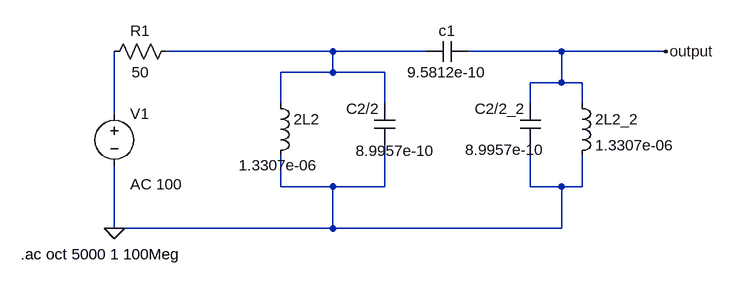
[diagram p0: schematic filtrPasmowoprzepustowyTypuPi.asc]
filtrPasmowoprzepustowyTypuPi.asc, the LTspice schematic file:
Version 4
SHEET 1 1032 680
WIRE 288 -16 32 -16
WIRE 432 -16 288 -16
WIRE 640 -16 496 -16
WIRE 800 -16 640 -16
WIRE 288 16 288 -16
WIRE 288 16 208 16
WIRE 368 16 288 16
WIRE 640 32 640 -16
WIRE 640 32 592 32
WIRE 672 32 640 32
WIRE 208 64 208 16
WIRE 368 64 368 16
WIRE 592 64 592 32
WIRE 672 64 672 32
WIRE -48 80 -48 -16
WIRE 208 192 208 144
WIRE 288 192 208 192
WIRE 368 192 368 128
WIRE 368 192 288 192
WIRE 592 192 592 128
WIRE 640 192 592 192
WIRE 672 192 672 144
WIRE 672 192 640 192
WIRE -48 256 -48 160
WIRE 288 256 288 192
WIRE 288 256 -48 256
WIRE 640 256 640 192
WIRE 640 256 288 256
FLAG -48 256 0
FLAG 800 -16 output
SYMBOL voltage -48 64 R0
WINDOW 123 24 124 Left 2
WINDOW 39 0 0 Left 0
SYMATTR Value2 AC 100
SYMATTR InstName V1
SYMATTR Value ""
SYMBOL res 48 -32 R90
WINDOW 0 0 56 VBottom 2
WINDOW 3 32 56 VTop 2
SYMATTR InstName R1
SYMATTR Value 50
SYMBOL ind 192 48 R0
WINDOW 3 -49 111 Left 2
SYMATTR InstName 2L2
SYMATTR Value 1.3307e-06
SYMBOL ind 656 48 R0
SYMATTR InstName 2L2_2
SYMATTR Value 1.3307e-06
SYMBOL cap 496 -32 R90
WINDOW 0 0 32 VBottom 2
WINDOW 3 32 32 VTop 2
SYMATTR InstName c1
SYMATTR Value 9.5812e-10
SYMBOL cap 384 128 R180
WINDOW 0 24 56 Left 2
WINDOW 3 -62 -9 Left 2
SYMATTR InstName C2/2
SYMATTR Value 8.9957e-10
SYMBOL cap 608 128 R180
WINDOW 0 24 56 Left 2
WINDOW 3 -7 -7 Left 2
SYMATTR InstName C2/2_2
SYMATTR Value 8.9957e-10
TEXT -192 296 Left 2 !.ac oct 5000 1 100Meg

The netlist it stands for:
* filtrPasmowoprzepustowyTypuPi.asc
V1 N002 0 AC 100
R1 N001 N002 50
L§2L2 N001 0 1.3307e-06
L§2L2_2 output 0 1.3307e-06
c1 output N001 9.5812e-10
C2/2 0 N001 8.9957e-10
C2/2_2 0 output 8.9957e-10
.ac oct 5000 1 100Meg
.backanno
.end